# EAGLE board EEZ CF-DIC r5B1 (EAGLE 7.2.0)
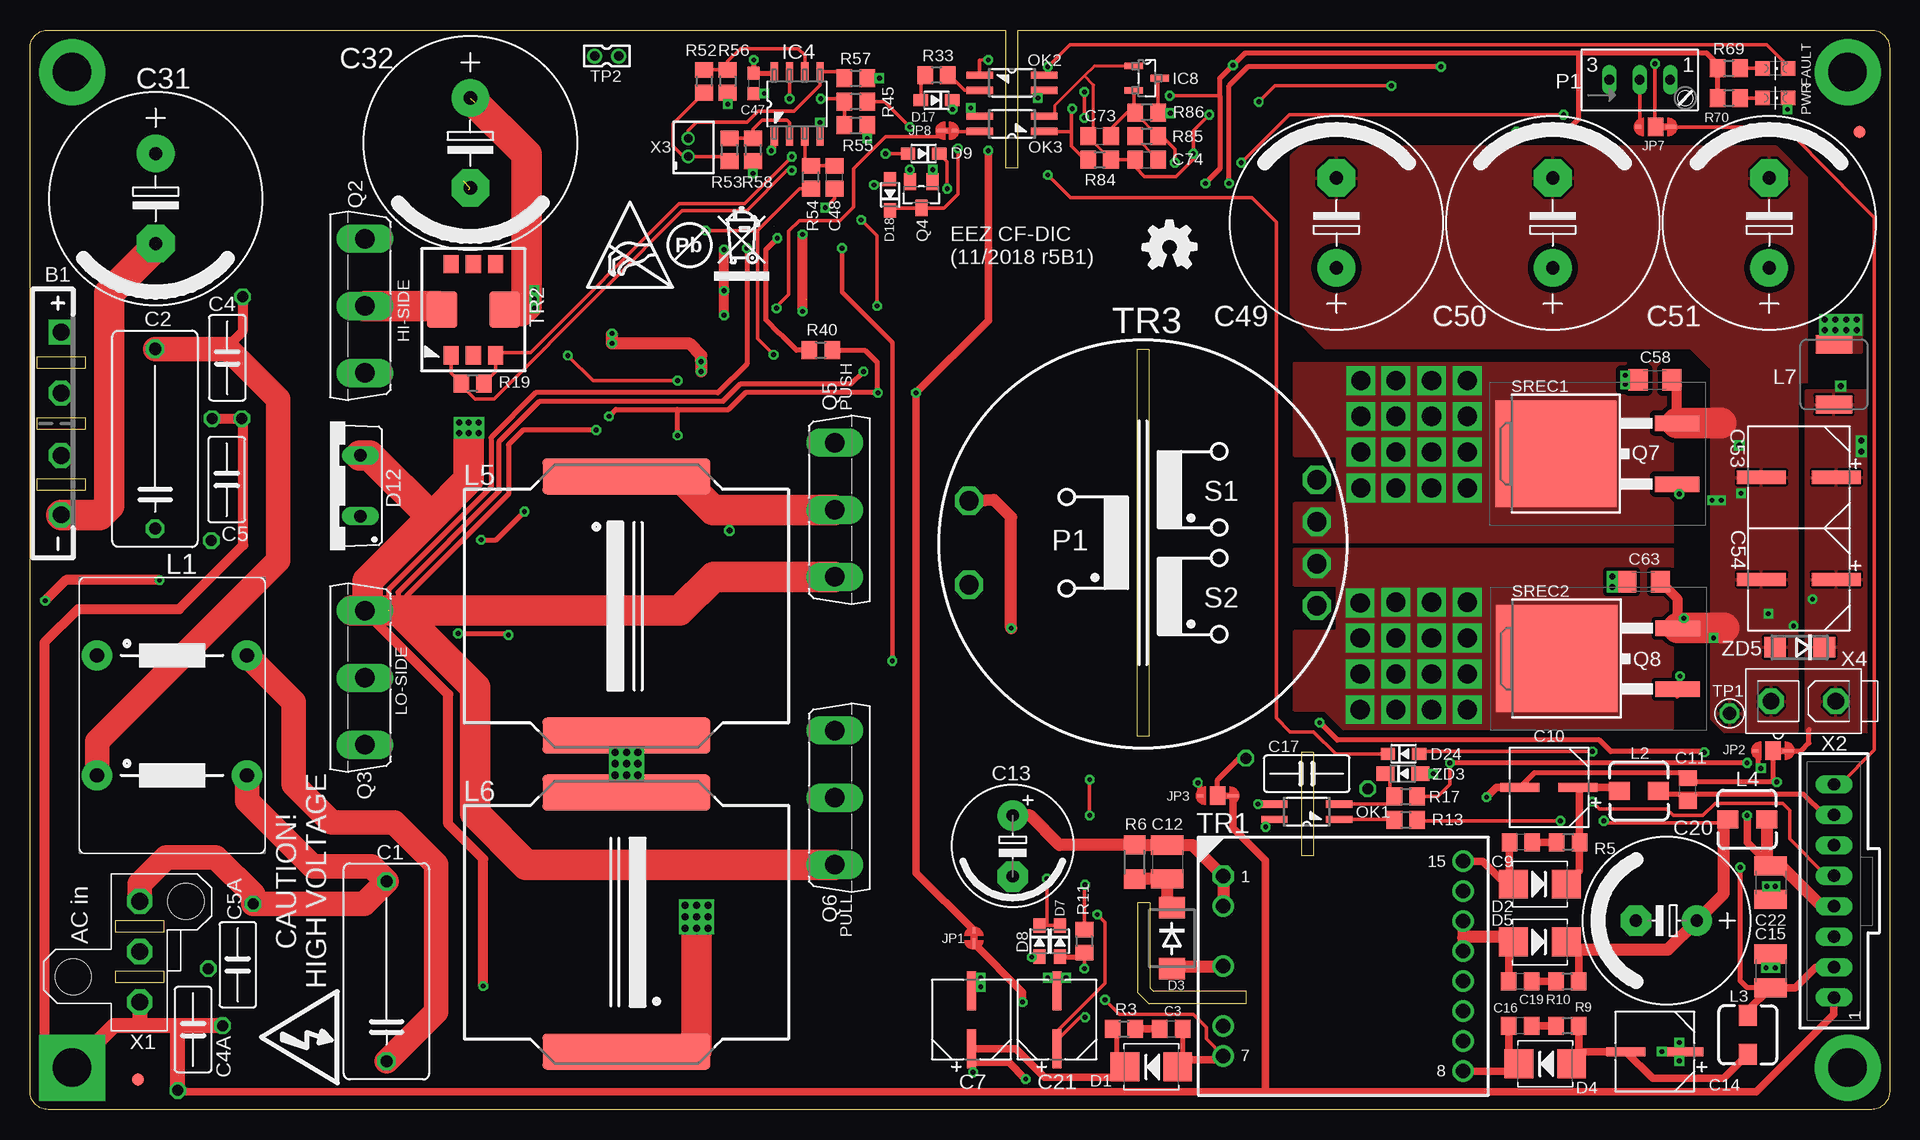
[diagram p3: board, top side]
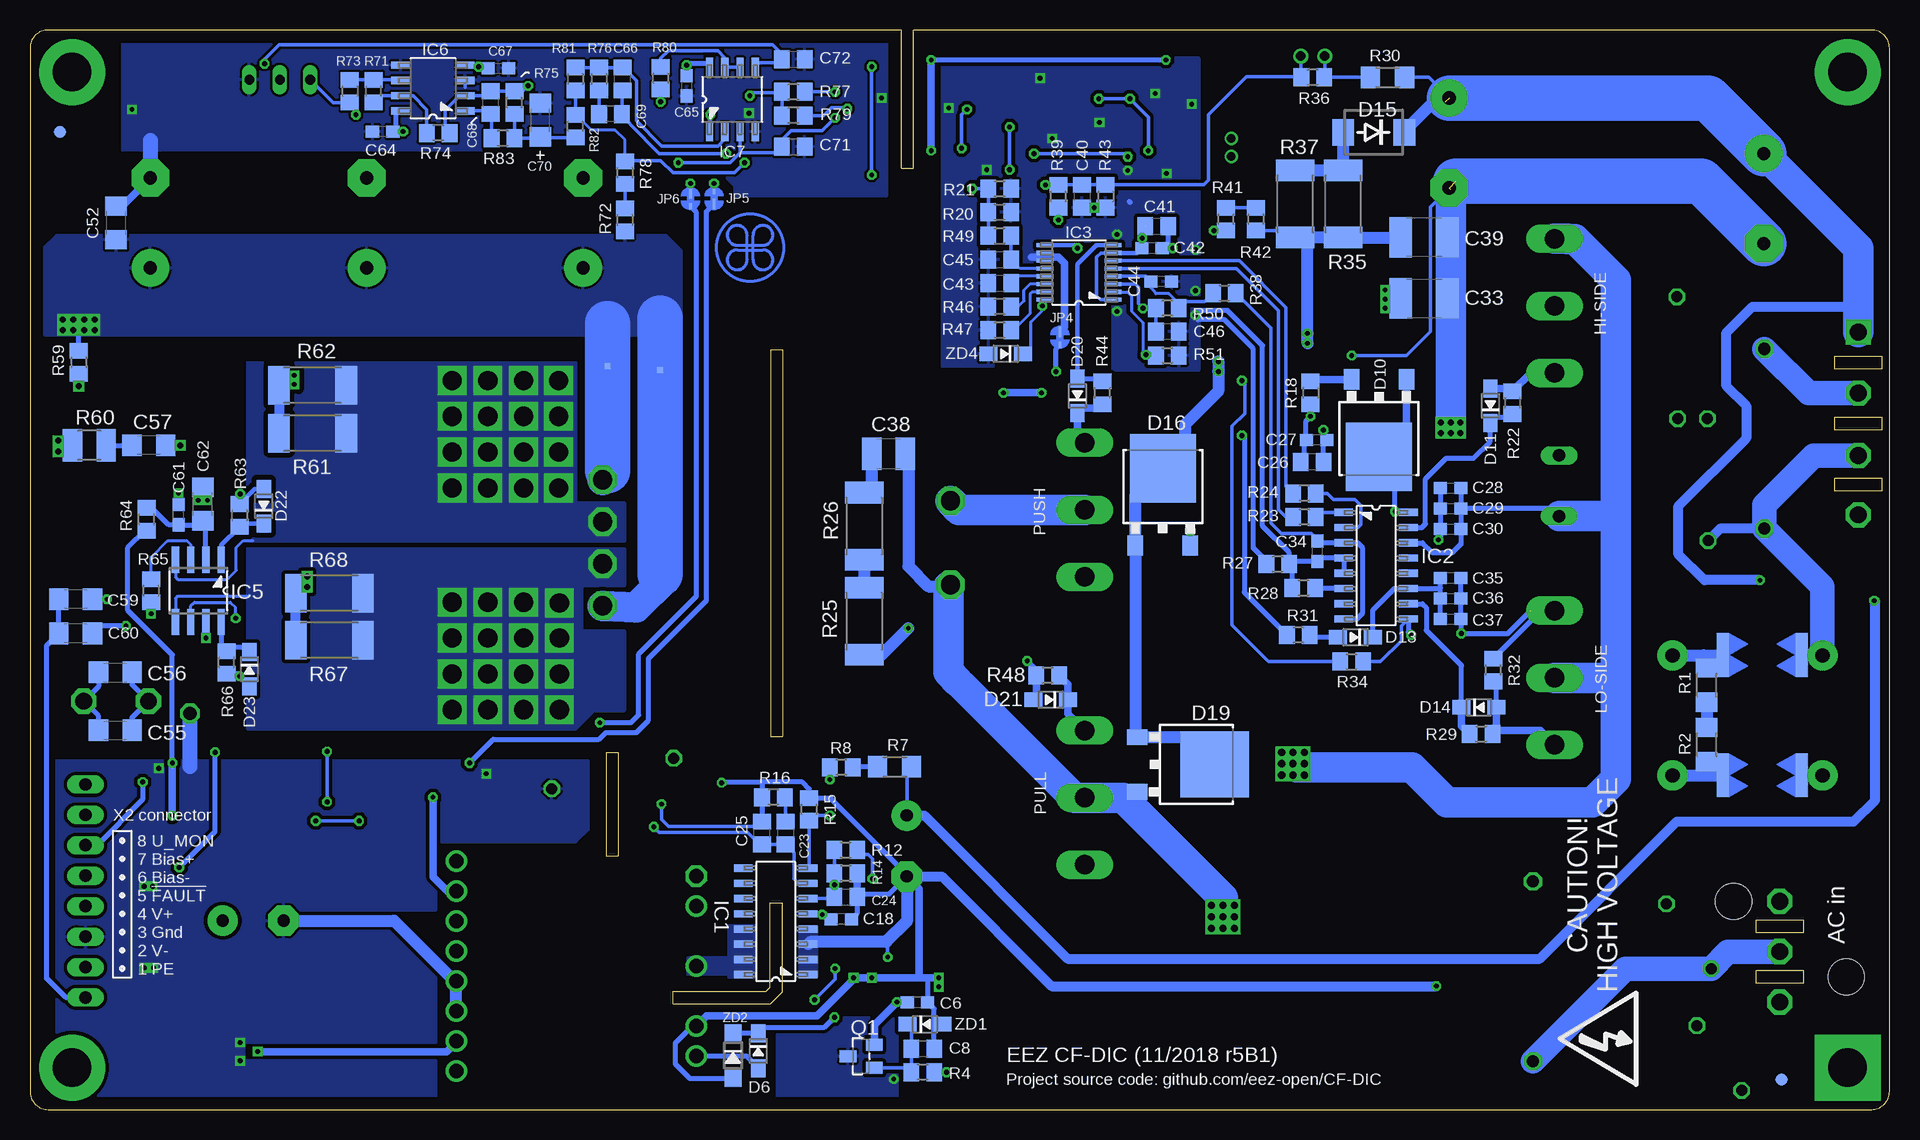
[diagram p4: board, bottom side, seen from below]

Size 155 x 90 mm. Coordinates in mm from the lower left corner, seen from the top.
Outline: 155,88.5 155,1.5 arc-90 153.5,0 1.5,0 arc-90 0,1.5 0,88.5 arc-90 1.5,90 81.34,90 81.34,78.49 82.36,78.49 82.36,90 153.5,90 arc-90 155,88.5
Outline: 92.27,63.37 92.27,31.11 93.28,31.11 93.28,63.37 92.27,63.37
Outline: 92.33,17.24 92.33,9.78 93.28,8.83 101.38,8.83 101.38,9.84 93.66,9.84 93.34,10.16 93.34,17.24 92.33,17.24
Outline: 105.98,29.78 105.98,21.14 107,21.14 107,29.78 105.98,29.78
Copper layers (1*16): Top 0.035mm / dielectric 1.5mm / Bottom 0.035mm
Design rules "default": minimum track width 6mil, minimum drill 0.3mm, track to track 6mil, track to pad 6mil, pad to pad 6mil, via to via 6mil, smd to smd 6mil, copper to edge 40mil, drill to drill 8mil, minimum pad ring 4mil, minimum via ring 8mil, stop-mask expansion 2.5mil, vias tented up to drill 0.55mm, thermal gap 8mil
Net classes: 0 default: width 0.203 mm, drill 0.3 mm, clearance 0.203 mm; 1 lvds: width 0.152 mm, drill 0.3 mm, clearance 0.152 mm to class 0, clearance 0.152 mm; 2 gnd: width 0.254 mm, drill 0.584 mm, clearance 0.254 mm

## Footprints (pad centres in the part's own frame; a part is rotated, then mirrored left to right if it is on the bottom)
GBU4K_CRE = drill 1.4 square: + -7.62,0 | drill 1.4 octagon: - 7.62,0; AC1 -2.54,0; AC2 2.667,0
C150-072X183 = drill 1.016 octagon: 1 -7.493,0; 2 7.493,0
C0805 = smd 1.3 x 1.5: 1 -0.95,0; 2 0.95,0
CY075-032X103 = drill 0.914 octagon: 1 -5.08,1.27; 2 5.08,-1.27
C0603 = smd 1.1 x 1: 1 -0.85,0; 2 0.85,0
CAPAE660X610N = smd 3.251 x 0.762: 1 -2.413,0; 2 2.413,0
C1210 = smd 1.6 x 2.7: 1 -1.4,0; 2 1.4,0
ECAP5/10.5 = drill 1.016 pad 2.54: + -2.54,0 | drill 1.016 pad 2.54 octagon: - 2.54,0
ECAP5/13 = drill 1.016 pad 2.54: + -2.54,0 | drill 1.016 pad 2.54 octagon: - 2.54,0
ECAP7.5/18 = drill 1.1 pad 3.14: + -3.75,0 | drill 1.1 pad 3.14 octagon: - 3.75,0
C1812 = smd 1.9 x 3.4: 1 -1.95,0; 2 1.95,0
C1206 = smd 1.6 x 1.8: 1 -1.4,0; 2 1.4,0
CAPAE830X1050N = smd 4.064 x 1.092: 1 -3.124,0; 2 3.124,0
EC1206 = smd 1.6 x 1.8: + -1.4,0; - 1.4,0
SMB = smd 2.4 x 2.4: A 2.2,0; C -2.2,0
DO214AA = smd 1.8 x 2.2: A 2.55,0; C -2.55,0
SOD323-W = smd 1.5 x 1.2: A 1.45,0; C -1.45,0
SOD323-R = smd 1.2 x 1: A 1.3,0; C -1.3,0
TO252 = smd 1.3 x 1.7: 1 -2.285,-5.49; 2 2.285,-5.49 | smd 5.5 x 5.7: 3 0,0.95
TO220-2 = drill 1.016 long: 1 -2.54,-2.54; 2 2.54,-2.54
LED_0805 = smd 1.2 x 1.2: A 0,-1.05; C 0,1.05
FIDUCIAL_DUAL = smd 1.016 x 1.016 bottom: B 0,0 | smd 1.016 x 1.016: T 0,0
SOIC-16 = smd 1.549 x 0.61: 1 -2.692,4.445; 2 -2.692,3.175; 3 -2.692,1.905; 4 -2.692,0.635; 5 -2.692,-0.635; 6 -2.692,-1.905; 7 -2.692,-3.175; 8 -2.692,-4.445; 9 2.692,-4.445; 10 2.692,-3.175; 11 2.692,-1.905; 12 2.692,-0.635; 13 2.692,0.635; 14 2.692,1.905; 15 2.692,3.175; 16 2.692,4.445
MTC16 = smd 1.422 x 0.356: 1 -2.845,2.275; 2 -2.845,1.625; 3 -2.845,0.975; 4 -2.845,0.325; 5 -2.845,-0.325; 6 -2.845,-0.975; 7 -2.845,-1.625; 8 -2.845,-2.275; 9 2.845,-2.275; 10 2.845,-1.625; 11 2.845,-0.975; 12 2.845,-0.325; 13 2.845,0.325; 14 2.845,0.975; 15 2.845,1.625; 16 2.845,2.275
SOIC127P600X173-8N = smd 1.55 x 0.6: 1 -2.7,1.9; 2 -2.7,0.63; 3 -2.7,-0.64; 4 -2.7,-1.91; 5 2.7,-1.91; 6 2.7,-0.64; 7 2.7,0.63; 8 2.7,1.9
SO8 = smd 0.6 x 2.2: 1 -1.905,-2.6; 2 -0.635,-2.6; 3 0.635,-2.6; 4 1.905,-2.6; 5 1.905,2.6; 6 0.635,2.6; 7 -0.635,2.6; 8 -1.905,2.6
SOT103P240X110-3N = smd 1.524 x 0.559: 1 -1.079,1.016; 2 -1.079,-1.016; 3 1.079,0
JP2-NOCUT = smd 0.889 x 0.254: 1 -0.445,0 | smd 0.508 x 0.254: 2 0.635,0
JP3-CUT = smd 1.27 x 1.524: COM 0,0 | smd 0.889 x 0.254: NC -1.27,0 | smd 0.508 x 0.254: NO 1.46,0
RN214 = drill 1.2 pad 2.54: 1 -6.25,-5; 2 6.25,-5; 3 -6.25,5; 4 6.25,5
DE0403 = smd 1.5 x 1.75: 1 0,1.626; 2 0,-1.625
MURATA_6000B = smd 3 x 14: 1 -10.8,0; 2 10.8,0
IHLP-2020BZ-11 = smd 3.048 x 1.524: 1 0,2.515; 2 0,-2.515
SO4 = smd 0.6 x 2.2: 1 -0.635,-2.7; 2 0.635,-2.7; 3 0.635,2.7; 4 -0.635,2.7
S64W = drill 0.813 long: A 2.54,1.27; E -2.54,1.27; S 0,1.27
SOT23-BEC = smd 1 x 1.4: B -0.95,-1.1; C 0,1.1; E 0.95,-1.1
TO247BV = drill 1.6 long: D 0,-2.921; G -5.588,-2.921; S 5.588,-2.921
SOT23 = smd 1 x 1.4: 1 -0.95,-1.1; 2 0.95,-1.1; 3 0,1.1
TO263 = smd 1.3 x 3.7: 1 -2.54,-7.87; 2 2.54,-7.87 | smd 8.9 x 10.1: 3 0,2.23
R1206 = smd 1.6 x 1.803: 1 -1.422,0; 2 1.422,0
R0805 = smd 1.3 x 1.5: 1 -0.95,0; 2 0.95,0
R2512 = smd 1.8 x 3.2: 1 -2.8,0; 2 2.8,0
R1210 = smd 1.6 x 2.7: 1 -1.4,0; 2 1.4,0
PCB-SAR_2.4MM = smd 3.632 x 1.016: 1 0,-3.302; 2 0,3.302
SHORT_NOHOLE = smd 0.5 x 0.25 bottom: P$1 0,0.117; P$2 0,-0.117
PCB_SHIELD_TAB = drill 1.1 octagon: 1 0,0
2MM-2 = drill 0.8 pad 1.27: 1 0,-1; 2 0,1
FERYSTER_5572 = drill 1.2 octagon: 1 -10,7.5 | drill 1.2: 2 -10,5; 4 -10,0; 6 -10,-5; 7 -10,-7.5; 8 10,-8.75; 9 10,-6.25; 10 10,-3.75; 11 10,-1.25; 12 10,1.25; 13 10,3.75; 14 10,6.25; 15 10,8.75
MURATA_5300 = smd 1.27 x 1.524: 1 -1.854,-3.81; 2 0,-3.81; 3 1.854,-3.81; 4 1.854,3.81; 5 0,3.81; 6 -1.854,3.81 | smd 2.54 x 3.048: 7 2.616,0; 8 -2.616,0
VAC_DUAL_SEC = drill 1.6 octagon: P1 -14.5,3.5; P1_DOT -14.5,-3.5; S1 14.5,5.25; S1_DOT 14.5,1.75; S2 14.5,-1.75; S2_DOT 14.5,-5.25
MINIFIT_39301039_CRE = drill 1.4 octagon: 1 0,4.2; 2 0,0; 3 0,-4.2 | hole 3: 5.55,2.1; -3.85,-4.2
70543-08 = drill 1.016 long: 1 -8.89,0; 2 -6.35,0; 3 -3.81,0; 4 -1.27,0; 5 1.27,0; 6 3.81,0; 7 6.35,0; 8 8.89,0
B2B-ZR = drill 0.7 pad 1.1: 1 -0.75,0; 2 0.75,0
MINIFIT_5566-02A = drill 1.4 octagon: 1 0,2.7; 2 0,-2.7
SOD123 = smd 1.4 x 1.4: A 1.9,0; C -1.9,0
DO214AC = smd 1.8 x 1.7: A 2.05,0; C -2.05,0

## Placement (x,y rotation side)
B1  GBU4K  [GBU4K_CRE]  2.6,57.2 270 top
C1  MKP-X2-220NR15/310  [C150-072X183]  29.72,11.52 90 top
C2  MKP-X2-220NR15/310  [C150-072X183]  10.42,55.92 90 top
C3  3n3  [C0805]  95.12,6.73 0 top
C4  CY1Y-470P  [CY075-032X103]  16.45,62.67 90 top
C4A  N.C.  [CY075-032X103]  13.6,6.67 90 top
C5  CY1Y-470P  [CY075-032X103]  16.38,52.51 270 top
C5A  N.C.  [CY075-032X103]  17.32,12.07 90 top
C6  N.C.  [C0603]  81.03,8.95 0 bottom
C7  EEEFK1V470P  [CAPAE660X610N]  78.49,7.49 90 top
C8  470n  [C0805]  80.58,5.08 0 bottom
C9  3n3  [C0805]  124.27,22.29 180 top
C10  EEEFK1V470P  [CAPAE660X610N]  126.62,26.86 180 top
C11  1u  [C0805]  138.18,26.67 90 top
C12  1n/1kV  [C1210]  94.81,20.64 270 top
C13  UCY2G6R8MPD  [ECAP5/10.5]  81.92,21.97 270 top
C14  EEEFK1V470P  [CAPAE660X610N]  135.45,4.83 180 top
C15  4u7  [C1210]  145.1,11.56 270 top
C16  3n3  [C0805]  124.21,6.99 180 top
C17  CY1Y-470P  [CY075-032X103]  106.43,28 0 top
C18  100n  [C0603]  87.38,15.88 180 bottom
C19  3n3  [C0805]  124.21,10.67 180 top
C20  470u  [ECAP5/13]  136.4,15.75 180 top
C21  EEEFK1V470P  [CAPAE660X610N]  85.6,7.49 90 top
C22  4u7  [C1210]  145.1,18.92 270 top
C23  33n  [C0805]  92.01,23.05 270 bottom
C24  100p  [C0805]  87,17.72 0 bottom
C25  2n2  [C0805]  93.98,23.05 90 bottom
C26  1u  [C0805]  48.13,53.98 180 bottom
C27  100n  [C0603]  47.75,55.82 180 bottom
C28  10n  [C0603]  36.58,51.82 0 bottom
C29  100n  [C0603]  36.58,50.1 0 bottom
C30  100n  [C0603]  36.58,48.39 0 bottom
C31  UCY2G121MHD  [ECAP7.5/18]  10.48,75.95 270 top
C32  UCY2G121MHD  [ECAP7.5/18]  36.7,80.58 270 top
C33  100n/500V  [C1812]  38.8,67.63 0 bottom
C34  100n  [C0603]  47.69,46.55 90 bottom
C35  10n  [C0603]  36.58,44.32 0 bottom
C36  100n  [C0603]  36.58,42.61 0 bottom
C37  100n  [C0603]  36.58,40.89 0 bottom
C38  4n7/200V  [C1210]  83.44,54.67 0 bottom
C39  100n/500V  [C1812]  38.8,72.71 180 bottom
C40  10n  [C0805]  67.31,76.14 270 bottom
C41  1u  [C0805]  61.09,73.66 0 bottom
C42  100n  [C0603]  61.47,71.82 0 bottom
C43  10n  [C0805]  74.17,68.9 0 bottom
C44  100n  [C0603]  60.71,69.02 180 bottom
C45  1n  [C0805]  74.17,70.87 0 bottom
C46  100p  [C0805]  60.2,64.83 180 bottom
C47  100n  [C0603]  60.33,85.53 270 top
C48  1u  [C0805]  67.06,77.72 90 top
C49  UPW1J152MHD  [ECAP7.5/18]  108.9,73.91 90 top
C50  UPW1J152MHD  [ECAP7.5/18]  126.94,73.91 90 top
C51  UPW1J152MHD  [ECAP7.5/18]  144.97,73.91 90 top
C52  1u/100V  [C1206]  147.83,73.91 90 bottom
C53  HHXC630ARA330MHA0G  [CAPAE830X1050N]  147.45,52.7 180 top
C54  HHXC630ARA330MHA0G  [CAPAE830X1050N]  147.45,44.2 180 top
C55  1u/100V  [C1206]  147.89,31.62 0 bottom
C56  100n/100V  [C1206]  147.89,36.45 0 bottom
C57  N.C.  [C1206]  145.1,55.37 180 bottom
C58  4n7/200V  [C1206]  135.45,60.83 0 top
C59  N.C.  [C1206]  151.19,42.55 180 bottom
C60  N.C.  [C1206]  151.19,39.69 180 bottom
C61  100n  [C0603]  142.62,49.59 90 bottom
C62  4u7  [C1206]  140.59,50.48 90 bottom
C63  4n7/200V  [C1206]  134.49,44.01 0 top
C64  100n  [C0603]  125.6,81.53 180 bottom
C65  100n  [C0603]  100.27,85.34 270 bottom
C66  100p  [C0805]  105.6,85.92 90 bottom
C67  100n  [C0603]  115.95,86.8 0 bottom
C68  100p  [C0805]  116.59,83.95 90 bottom
C69  33n  [C0805]  106.62,82.99 180 bottom
C70  4u7  [EC1206]  112.46,82.49 90 bottom
C71  1u  [C0805]  91.38,80.26 0 bottom
C72  N.C.  [C0805]  91.38,87.57 0 bottom
C73  N.C.  [C0805]  89.15,81.15 0 top
C74  1n  [C0805]  93.09,79.18 0 top
D1  SS110B  [SMB]  93.47,3.56 0 top
D2  SS110B  [SMB]  125.86,18.8 180 top
D3  US1K-DIO  [DO214AA]  95.19,14.29 270 top
D4  SS110B  [SMB]  126.3,3.81 0 top
D5  SS110B  [SMB]  125.86,13.97 180 top
D6  1N5819HW-7-F  [SOD323-W]  94.3,4.89 270 bottom
D7  BAS316  [SOD323-R]  85.85,14.03 270 top
D8  BAS316  [SOD323-R]  84.14,14.03 270 top
D9  BAS316  [SOD323-R]  74.49,79.69 180 top
D10  C3D02065E  [TO252]  42.55,55.37 180 bottom
D11  N.C.  [SOD323-W]  33.27,58.67 90 bottom
D12  C3D06065A  [TO220-2]  25,52 90 top
D13  1N5819HW-7-F  [SOD323-W]  44.51,39.37 180 bottom
D14  N.C.  [SOD323-W]  34.23,33.53 0 bottom
D15  US1M-DIO  [DO214AA]  42.99,81.47 180 bottom
D16  C3D02065E  [TO252]  60.58,52.51 0 bottom
D17  BAS316  [SOD323-R]  75.56,84.14 180 top
D18  BAS316  [SOD323-R]  71.69,76.26 90 top
D19  C3D02065E  [TO252]  57.21,28.77 270 bottom
D20  1N5819HW-7-F  [SOD323-W]  67.69,59.5 90 bottom
D21  1N5819HW-7-F  [SOD323-W]  69.91,34.16 180 bottom
D22  1N5819HW-7-F  [SOD323-W]  135.51,50.29 90 bottom
D23  1N5819HW-7-F  [SOD323-W]  136.72,36.7 270 bottom
D24  BAS316  [SOD323-R]  114.49,29.65 0 top
EEZ_SIGNATURE  SIGNATURESMALL  [SIGNATURE_5MM]  94.98,71.86 180 top
FAULT  LTST-C170KRKT  [LED_0805]  145.48,86.8 270 top
FM1  FIDUCIAL_2  [FIDUCIAL_DUAL]  152.5,81.5 0 top
FM2  FIDUCIAL_2  [FIDUCIAL_DUAL]  9,2.5 0 top
IC1  VIPer35L  [SOIC-16]  92.84,15.68 180 bottom
IC2  SI8233BB-D-IS1  [SOIC-16]  42.8,45.34 0 bottom
IC3  LM5041B  [MTC16]  67.56,69.79 180 bottom
IC4  LM258D  [SOIC127P600X173-8N]  63.94,83.82 90 top
IC5  IR11688STRPBF  [SO8]  140.97,43.24 180 bottom
IC6  TL072  [SOIC127P600X173-8N]  121.41,85.15 180 bottom
IC7  TL103W  [SOIC127P600X173-8N]  96.46,84.2 90 bottom
IC8  TL431  [SOT103P240X110-3N]  93.09,85.98 0 top
JP1  JP2-NOCUT  [JP2-NOCUT]  78.68,14.29 90 top
JP2  JP3-CUT  [JP3-CUT]  145.29,29.91 180 top
JP3  JP3-CUT  [JP3-CUT]  99,26.16 180 top
JP4  JP2-NOCUT  [JP2-NOCUT]  69.15,64.39 270 bottom
JP5  JP2-NOCUT  [JP2-NOCUT]  97.98,75.95 90 bottom
JP6  JP2-NOCUT  [JP2-NOCUT]  99.95,75.95 270 bottom
JP7  JP3-CUT  [JP3-CUT]  135.51,81.92 180 top
JP8  JP2-NOCUT  [JP2-NOCUT]  76.45,81.6 0 top
L1  RN214-2.5-02-3M3  [RN214]  11.85,32.85 0 top
L2  DLG-0403-180  [DE0403]  134.11,26.54 90 top
L3  DLG-0403-180  [DE0403]  143.19,6.22 180 top
L4  DLG-0403-180  [DE0403]  143.13,24.19 90 top
L5  60B684C  [MURATA_6000B]  49.72,41.97 270 top
L6  60B684C  [MURATA_6000B]  49.72,15.62 90 top
L7  IHLP2020CZER3R3M11  [IHLP-2020BZ-11]  150.37,61.28 0 top
OK1  TLP291-GB.SE-T  [SO4]  106.43,24.83 90 top
OK2  TLP291-GB.SE-T  [SO4]  81.85,85.6 270 top
OK3  TLP291-GB.SE-T  [SO4]  81.85,82.17 90 top
P1  T910W-50K  [S64W]  134.18,84.58 0 top
PWR  LTST-C170YKT  [LED_0805]  145.48,84.33 270 top
Q1  MMBT5551  [SOT23-BEC]  85.72,4.45 90 bottom
Q2  C3M0280090D  [TO247BV]  25,67 90 top
Q3  C3M0280090D  [TO247BV]  25,36 90 top
Q4  NYC0102BLT1G  [SOT23]  74.3,76.26 180 top
Q5  C3M0280090D  [TO247BV]  70,50 270 top
Q6  C3M0280090D  [TO247BV]  70,26 270 top
Q7  IRFS4321PBF  [TO263]  129.41,54.67 90 top
Q8  IRFS4321PBF  [TO263]  129.48,37.59 90 top
R1  220K  [R1206]  15.24,35.38 270 bottom
R2  220K  [R1206]  15.24,30.43 270 bottom
R3  120R  [R0805]  91.19,6.73 0 top
R4  1K8  [R0805]  80.58,3.11 180 bottom
R5  120R  [R0805]  128.21,22.29 180 top
R6  220K  [R1206]  92.08,20.64 270 top
R7  220K  [R1206]  82.93,28.57 180 bottom
R8  100K  [R0805]  87.38,28.51 180 bottom
R9  120R  [R0805]  128.14,6.99 180 top
R10  120R  [R0805]  128.14,10.67 180 top
R11  N.C.  [R0805]  87.88,14.03 270 top
R12  47K  [R0805]  87,21.65 0 bottom
R13  750R  [R0805]  114.68,24.13 180 top
R14  12K  [R0805]  87,19.68 180 bottom
R15  1K8  [R0805]  90.04,25.02 90 bottom
R16  47K  [R0805]  93.03,26.04 180 bottom
R17  1K  [R0805]  114.68,26.1 0 top
R18  10R  [R0805]  48.26,59.75 270 bottom
R19  10K  [R0805]  36.89,60.54 180 top
R20  6R2  [R0805]  74.17,74.8 0 bottom
R21  N.C.  [R0805]  74.17,76.77 0 bottom
R22  10R  [R0805]  31.43,58.93 270 bottom
R23  100R  [R0805]  48.77,49.4 180 bottom
R24  100R  [R0805]  48.77,51.37 180 bottom
R25  22R/2-3W  [R2512]  85.47,40.7 270 bottom
R26  22R/2-3W  [R2512]  85.47,48.64 270 bottom
R27  1R  [R0805]  50.99,45.47 180 bottom
R28  30K  [R0805]  48.83,43.5 0 bottom
R29  10R  [R0805]  34.04,31.31 0 bottom
R30  220K  [R1206]  41.85,86.04 180 bottom
R31  10R  [R0805]  49.28,39.56 180 bottom
R32  47K  [R0805]  33.02,36.64 90 bottom
R33  1K  [R0805]  75.56,86.23 180 top
R34  1R  [R0805]  44.83,37.34 0 bottom
R35  22R/2-3W  [R2512]  45.53,75.5 90 bottom
R36  100K  [R0805]  48.07,86.04 180 bottom
R37  22R/2-3W  [R2512]  49.53,75.5 90 bottom
R38  10R  [R0805]  55.44,68.07 0 bottom
R39  1K  [R0805]  69.28,76.14 90 bottom
R40  10R  [R0805]  65.91,63.31 0 top
R41  30K  [R0805]  55.31,74.23 90 bottom
R42  100K  [R0805]  52.83,74.23 270 bottom
R43  10K  [R0805]  65.34,76.14 270 bottom
R44  22R  [R0805]  65.6,59.75 90 bottom
R45  4K7  [R0805]  68.83,84.01 180 top
R46  33K  [R0805]  74.17,66.93 180 bottom
R47  51K  [R0805]  74.17,64.96 180 bottom
R48  22R  [R0805]  70.17,36.2 180 bottom
R49  1K  [R0805]  74.17,72.83 0 bottom
R50  N.C.  [R0805]  60.2,66.8 180 bottom
R51  750R  [R0805]  60.2,62.87 0 bottom
R52  4K7  [R0805]  56.2,85.72 270 top
R53  5K6  [R0805]  58.29,80.01 270 top
R54  30K  [R0805]  65.09,77.72 90 top
R55  1K  [R0805]  68.83,82.04 0 top
R56  30K  [R0805]  58.17,85.72 270 top
R57  10K  [R0805]  68.83,85.98 0 top
R58  1K  [R0805]  60.26,80.01 270 top
R59  120R  [R0805]  150.94,62.29 270 bottom
R60  N.C.  [R1210]  150.05,55.37 180 bottom
R61  22R/2-3W  [R2512]  131.44,56.39 180 bottom
R62  22R/2-3W  [R2512]  131.44,60.39 180 bottom
R63  3R3  [R0805]  137.54,49.53 270 bottom
R64  10R  [R0805]  145.29,49.21 90 bottom
R65  47K  [R0805]  144.91,43.24 270 bottom
R66  3R3  [R0805]  138.62,37.27 90 bottom
R67  22R/2-3W  [R2512]  130.05,39.12 180 bottom
R68  22R/2-3W  [R2512]  130.05,43.05 180 bottom
R69  470R  [R0805]  141.6,86.8 0 top
R70  470R  [R0805]  141.6,84.33 0 top
R71  10K  [R0805]  126.36,84.9 90 bottom
R72  316K  [R0805]  105.41,74.17 270 bottom
R73  10K  [R0805]  128.33,84.9 270 bottom
R74  750R  [R0805]  120.97,81.41 180 bottom
R75  750R  [R0805]  114.62,83.95 90 bottom
R76  30K  [R0805]  107.57,85.92 270 bottom
R77  1K8  [R0805]  91.38,84.84 180 bottom
R78  12K  [R0805]  105.41,78.11 270 bottom
R79  470R  [R0805]  91.38,82.87 180 bottom
R80  750R  [R0805]  102.43,85.98 90 bottom
R81  10K  [R0805]  109.54,85.92 270 bottom
R82  16K  [R0805]  109.54,81.98 90 bottom
R83  220R  [R0805]  115.57,80.96 180 bottom
R84  750R  [R0805]  89.15,79.18 0 top
R85  6K8  [R0805]  93.09,81.15 0 top
R86  7K5  [R0805]  93.09,83.12 180 top
SAR1  PCB 2.4mm  [PCB-SAR_2.4MM]  10.6,37.9 270 bottom
SAR2  PCB 2.4mm  [PCB-SAR_2.4MM]  10.6,27.86 270 bottom
SH1  [SHORT_NOHOLE]  10.48,72.07 180 bottom
SH2  [SHORT_NOHOLE]  106.87,61.98 180 top
SH3  [SHORT_NOHOLE]  102.49,61.66 0 top
TP1  [PCB_SHIELD_TAB]  141.67,33.02 180 top
TP2  [2MM-2]  48.07,87.82 270 top
TR1  Feryster 5572  [FERYSTER_5572]  109.47,11.95 0 top
TR2  53100C  [MURATA_5300]  36.96,66.67 0 top
TR3  VAC T60006-L2025-W380  [VAC_DUAL_SEC]  92.77,47.24 0 top
U$2  [RECYCLE_BIN1/8]  57.03,69.09 0 top
U$4  [ESD_SYMBOL]  46.45,68.56 0 top
U$5  [PB_SMALL]  54.99,72.07 180 top
X1  39-30-1039  [MINIFIT_39301039_CRE]  9.16,13.16 180 top
X2  90136-1208  [70543-08]  150.37,18.22 90 top
X3  B2B-ZR  [B2B-ZR]  54.86,80.2 90 top
X4  39-28-1023  [MINIFIT_5566-02A]  147.83,34.04 270 top
ZD1  BZX384-C13  [SOD323-W]  80.39,7.11 0 bottom
ZD2  BZT52C20-DC  [SOD123]  96.39,4.51 270 bottom
ZD3  MMSZ5V1T1G  [SOD323-W]  114.43,28 0 top
ZD4  PDZ6.2B  [SOD323-W]  73.66,62.99 180 bottom
ZD5  SMAJ58A-TR  [DO214AC]  147.51,38.54 180 top

## Tracks (layer width: path | path; a pad name or v marks a point on that pad's centre or on a via)
0V  (via drill 0.4, 0.5)  (4 unrouted)
  Top 0.305: D8.A 83.54,12.73 v83.5,12.7 | OK1.3 v102.36,25.46 | v53.98,60.77 46.93,60.77 v44.83,62.87 | 28.13,42.02 28.13,41.8 Q3.S | 31.43,41.59 29.97,41.59 29.94,41.56 29.94,42.13 29.91,42.16
  Top 0.406: JP3.NO 97.54,27.05 v97.35,27.24 | v59.75,71.82 59.75,62.17 57.34,59.75 42.16,59.75 38.42,56.01 38.42,51.88 29.91,43.37 29.91,42.16 | 30.67,40.75 30.67,41.59 30.67,43.12 39.12,51.56 39.12,55.69 42.48,59.05 57.78,59.05 59.24,60.52 68.45,60.52 v69.47,61.53 | v47.18,56.64 41.08,56.64 39.88,55.44 39.88,51.31 31.43,42.86 31.43,41.59 | v35.69,39.69 39.75,39.69 v39.88,39.56 | C7.2 78.8,10.22 v79.25,10.22 v79.25,10.99 | C21.2 85.6,10.92 85.66,10.99 | v37.4,57.28 v36.58,57.28 v35.75,57.28 v35.75,56.39 v36.58,56.39 v37.4,56.39
  Top 0.61: v86.36,10.99 85.66,10.99 v84.84,10.99
  Top 0.813: Q3.S 28.1,41.37 34.86,34.61 34.86,23.81 37.78,20.89 v37.78,10.29
  Top 2.54: 33.47,49.4 36.58,52.51 v36.58,56.39 | 33.47,49.4 28.13,44.07 28.13,42.02 | 30.67,41.59 37.08,35.18 37.08,24.7 41.37,20.41 Q6.S | 26.86,41.59 30.67,41.59 | 30.67,41.59 31.43,41.59 54.17,41.59 56.98,44.41 Q5.S | D12.2 28.33,54.54 33.47,49.4
  Bottom 0.305: v83.5,12.7 83.5,13.84 83.63,13.97 | v102.36,25.46 102.36,24.19 101.79,23.62 94.36,23.62 C25.2 | R16.2 | 45.78,37.21 R34.1 51.75,37.34 54.8,40.39 54.8,56.96 53.72,58.04 53.72,60.52 v53.98,60.77 | R34.2 42.42,37.34 40.7,39.05 40.7,40.3 IC2.9 | C32.- 38.29,75.24 38.29,64.83 40.26,62.87 v44.83,62.87 | C39.1 36.58,72.71 | C33.2 36.64,67.63 36.58,67.56
  Bottom 0.406: 80.18,10.96 C6.2 79.63,8.41 79.63,7.18 | C8.2 79.63,7.18 | ZD1.A 79.57,7.11 79.63,7.18 | R14.1 86.05,19.5 86.04,17.97 83.38,17.97 C13.- 81.92,19.56 88.33,25.97 R15.2 90.04,26.73 90.61,27.3 93.98,27.3 | C25.2 R16.2 93.98,27.3 | 93.98,27.3 97.28,27.3 v97.35,27.24 | C24.2 86.05,16.36 C18.1 | ZD2.A 100.01,2.6 101.22,3.81 101.22,5.52 99.79,6.95 TR1.6 | C35.2 C36.2 C37.2 35.69,41.11 v35.69,39.69 31.81,39.69 29.91,41.59 29.02,41.59 | C41.2 60.14,72.3 C42.2 v59.75,71.82 | IC2.9 40.11,39.79 v39.88,39.56 | v47.18,56.64 47.18,56.09 C27.1 47.18,55.53 C26.1 | R32.2 29.02,41.59 | 29.02,41.59 Q3.S | v69.47,61.53 69.47,63.44 JP4.2 | 36.58,57.4 v36.58,57.28
  Bottom 0.61: 80.9,10.99 v84.84,10.99 v86.36,10.99 86.23,10.99 89.41,7.81 98.61,7.81 TR1.6 | 80.9,10.99 80.2,10.99 | 80.2,10.99 v79.25,10.99 | 80.18,10.96 80.2,10.99 | R14.1 C24.2 | 80.9,10.99 80.9,18.41 C13.-
  Bottom 0.813: v37.78,10.29 69.85,10.29 78.99,19.43 C13.-
  Bottom 1.016: C13.- 81.92,15.68 83.63,13.97 89.95,13.97 IC1.3
  Bottom 2.54: 36.58,57.4 36.58,67.56 36.58,72.71 36.58,76.7
  Bottom 3.81: C31.- 15.69,77.41 36.13,77.41
  pour Bottom (no thermals): 89.41,11.05 89.41,15.24 90.87,15.24 90.87,11.05
6VAC
  Top 0.61: C19.2 123.26,13.44 | 123.26,13.44 D5.A | 123.26,13.44 123.26,14.41 123.25,14.41 | 119.54,14.41 119.47,14.35
  Top 1.016: TR1.13 119.47,14.35 TR1.12 | 123.25,14.41 119.54,14.41
7VAC
  Top 0.61: TR1.8 123.49,3.2 D4.C 123.26,4.66 C16.2
15VAC
  Top 0.61: TR1.15 121.09,20.7 122.68,19.11 123.59,19.11 D2.A 123.32,19.39 C9.2
!FAULT  (via drill 0.4)
  Top 0.305: D24.C 108.84,29.65 107,31.5 105.03,31.5 103.89,32.64 103.89,73.98 101.85,76.01 86.74,76.01 v84.84,77.92 | FAULT.C 146.53,87.03 144.78,88.77 86.68,88.77 v84.84,86.93 84.84,86.2 OK2.4
  Bottom 0.305: v84.84,77.92 v84.84,86.93
+2.5VREF  (via drill 0.4)
  Top 0.305: v127.83,82.93 104.97,82.93 v100.97,78.93 | v87.88,84.84 v87.88,82.68
  Bottom 0.305: P1.E 129.73,83.95 R73.2 127.89,83.95 127.83,83.88 v127.83,82.93 | 95.82,81.82 IC7.3 | 92.64,80.33 C71.1 | 90.43,85.22 R77.1 v87.88,84.84 | IC7.3 | 95.82,79.76 96.65,78.93 v100.97,78.93 | IC7.3 95.82,79.76 | C71.1 92.33,80.83 91.57,81.6 88.96,81.6 v87.88,82.68 | 95.82,79.76 92.83,79.76 C71.1
+5VREF
  Top 0.305: R53.2 57.9,79.45 X3.1 54.47,79.45 53.59,80.33 53.59,82.17 R52.2
+6V_REC  (via drill 0.4)
  Top 0.305: 115.82,24.13 R13.1 115.89,24.07 v127.57,24.07 | v131.19,24.07 131.38,23.88 141.19,23.88 L4.1
  Top 0.61: R10.1 129.09,13.15 128.91,13.34
  Top 1.016: D5.C 127.99,13.42 128.08,13.34 128.91,13.34 136.53,13.34 C20.+ 141.19,18 141.19,23.88
  Bottom 0.305: v131.19,24.07 v127.57,24.07
+12V  (via drill 0.4)
  Top 0.305: OK2.1 79.15,87.47 v79.88,87.5
  Top 0.406: v60.33,87.5 C47.1 61.91,86.39 IC4.8 | R40.2 69.6,63.31 70.61,62.29 70.61,59.69 v70.67,59.75 59.63,59.75 58.23,58.36 53.98,58.36 | v48.26,57.78 48.83,58.36 53.98,58.36 | v53.98,56.2 53.98,58.36
  Top 0.61: JP1.2 73.85,19.75 v73.85,59.75 79.88,65.79 v79.88,79.95
  Bottom 0.406: v53.98,56.2 53.78,56.01 53.78,43.12 R31.2 | 47.76,58.42 R18.2 v48.26,57.78 48.64,57.4 48.64,55.85 C27.2 48.77,55.65 48.77,53.98 C26.2 | v79.88,87.5 v60.33,87.5
  Bottom 0.61: v70.67,59.75 v73.85,59.75 | v79.88,87.5 v79.88,79.95
+15V_REC
  Top 0.61: D2.C 129.16,19.89 R5.1 129.16,26.74 C10.1 132.17,26.86 L2.1
-7V_REC
  Top 0.61: R9.1 129.09,4.51 | 129.09,4.51 129.09,4.4 D4.A | 129.09,4.51 129.41,4.83 C14.2 135.25,2.6 141.2,2.6 L3.1 142.9,4.6
-15V  (via drill 0.4)
  Top 0.406: C10.2 125.41,28.07 138.18,28.07 C11.2 | 138.31,28 C11.2 | JP2.COM 145.29,27.62 v145.61,27.3 138.49,27.3 C11.2
  Top 0.61: C10.2 122.24,26.86 v121.41,26.04
  Bottom 0.406: v145.61,27.3 145.61,25.84 149.42,22.04 X2.6
  Bottom 0.61: TR1.14 120.21,18.2 121.41,19.41 v121.41,26.04
AC_L_IN
  Top 2.032: C1.1 33.85,8.15 33.85,20.45 30.35,23.94 25.15,23.94 21.97,27.11 21.97,33.98 L1.4
  Bottom 1.016: L1.4 15.49,37.85 | 15.49,37.85 13.95,37.85 SAR1.1 | R1.1 15.24,37.6 15.49,37.85
  Bottom 2.032: C1.1 22,11.74 C4A.2 13.46,13.16 X1.2
AC_N_IN
  Top 2.032: L1.2 18.1,25.72 23.56,20.26 28.48,20.26 C1.2 27.86,17.15 C5A.2 18.59,17.92 15.49,21.02 11.37,21.02 9.15,18.81 X1.3
  Bottom 1.016: L1.2 15.18,27.86 | 15.18,27.86 13.91,27.86 SAR2.1 | R2.2 15.24,27.92 15.18,27.86
AGND  (via drill 0.4)
  Top 0.305: TR2.1 35.1,61.38 R19.2 35.94,60.39 37.08,59.24 38.67,59.24 47.85,68.42 48.01,68.58 54.36,74.93 59.75,74.93 63.12,78.3 v63.5,78.3 | OK3.3 78.55,82.8 78.42,82.93 v78.42,83.5 | v70.8,85.98 R57.2 | v69.79,80.96 R55.2 | IC4.4 v65.86,82.29 v65.85,82.3 | C47.2 61.19,84.68 v61.21,84.71 | R56.2 v58.17,83.82 | Q4.1 75.25,78.04 v75.25,78.36 | R58.2 v60.26,78.04 | C48.1 67.06,75.95 v66.29,75.18
  Top 0.813: v64.39,66.55 v64.39,72.96 | v57.85,71.69 v57.85,68.26 v57.85,66.23
  Bottom 0.406: IC2.5 IC2.4 47.41,45.97 C34.1 49.81,45.7 R27.1 | v57.85,66.23 57.66,65.85 55.44,65.85 53.02,63.44 53.02,46.8 51.94,45.72 R27.2 | 57.85,66.42 57.66,66.61 55.18,66.61 52.26,63.69 52.26,48.64 50.04,46.42 R27.1 | 63.37,75.69 63.31,75.63 | R28.1 49.78,45.21 R27.1
  Bottom 0.61: 71.5,71.06 69.28,71.06 68.77,70.55 68.77,65.22 JP4.1
  pour Bottom (isolate 0.305): 74.68,61.98 74.68,70.42 69.85,70.36 69.85,72.39 64.77,72.39 64.77,61.66 57.53,61.66 57.53,87.63 78.99,87.63 78.99,61.98
AUX_AC  (via drill 0.4)
  Top 0.305: R11.2 v87.88,11.75 | TR1.7 98.04,5.88 98.04,6.86 96.97,7.94 90.81,7.94 v89.6,9.14
  Top 0.406: D7.A 87.53,12.73 R11.2 | 95.95,4.15 D1.A | C3.2 96.07,4.28 96.2,4.15
  Top 0.61: 95.95,4.15 96.2,4.15 99.17,4.15 TR1.7
  Bottom 0.305: v87.88,11.75 87.88,10.86 v89.6,9.14
  Bottom 0.406: D6.A 94.3,3.49 95.25,4.45 TR1.7
AUX_REC  (via drill 0.4)
  Top 0.406: v78.61,3.11 78.61,3.94 78.55,4 C7.1 | R3.1 90.42,6.73 90.55,6.6 90.55,4.28 D1.C
  Top 0.61: D1.C 91.33,3.64 90.36,2.67 84.58,2.67 82.17,5.08 C7.1 | v83,2.54 81.6,3.94 78.61,3.94
  Bottom 0.406: R4.1 v78.61,3.11
  pour Bottom (isolate 0.305): 82.68,7.62 92.71,7.62 92.71,0.06 82.68,0.06
BUCK_OUT  (via drill 0.6)
  Top 2.184: L5.2 45.28,31.17 | L6.2 54.16,26.42
  Top 2.54: v49.72,28.83 L6.2 | v49.72,29.78 L5.2
  Bottom 0.305: v50.67,29.78 v49.72,29.78 v48.77,29.78 v48.77,28.83 | v49.72,28.83 v50.67,28.83 | v50.67,27.88 v49.72,27.88 v48.77,27.88 v48.77,28.83 | v48.77,28.83 48.77,28.51 49.28,28.51
  Bottom 0.406: 35.69,50.14 C29.2 C30.2 35.73,47.14 36.45,46.42 38.1,46.42 38.92,47.24 IC2.14 | 22.16,46.8 22.8,46.29 | 35.69,50.14 28.22,50.14 D12.1 | 35.69,50.14 35.69,51.78 C28.2
  Bottom 0.508: C28.2 35.73,51.84
  Bottom 2.54: 22.8,49.02 22.8,46.29 22.8,36.01 | 22.8,49.02 22.8,69.15 26.23,72.58 26.86,72.58 26.87,72.59 Q2.S | v49.72,28.83 49.4,28.51 49.28,28.51 39.81,28.51 36.89,25.59 24.77,25.59 22.8,27.56 22.8,36.01 | Q3.D 22.8,36 22.8,36.01 | D12.1 23.23,49.46 22.8,49.02
CLAMP_C  (via drill 0.4)
  Top 1.016: 48.51,64.64 v48.51,63.88 54.93,63.88 55.94,62.87 v55.94,62.36 v55.94,61.53
  Bottom 0.305: R42.2 50.11,73.28 49.91,73.08 R37.1
  Bottom 0.406: D19.1 62.86,31.21
  Bottom 1.016: D19.1 58.55,31.05 D19.3 | D16.3 62.86,51.18 D16.1 62.86,31.21 | v48.51,64.71 v48.51,63.88 48.51,72.45 48.77,72.7 | v55.94,62.36 v55.94,61.53 55.94,59.88 58.67,57.15 58.67,53.72 | 48.77,72.7 R35.1 C39.2 | 48.77,72.7 R37.1 | 50.61,72.39 49.91,73.08
  Bottom 1.27: 56.01,29.02 D19.3 | 60.45,53.47 D16.3 60.58,53.78 58.74,53.78 58.67,53.72
COMP  (via drill 0.4)
  Top 0.305: v62.23,66.81 62.23,66.93 63.25,67.94 63.25,73.22 64.14,74.11 67.5,74.11 68.64,75.25 68.64,78.42 71.31,81.09 76.01,81.09 JP8.1
  Bottom 0.305: IC3.3 62.84,68.81 62.61,68.58 62.61,67.19 v62.23,66.81 62.04,66.8 R50.2 C46.2
CT_OUT  (via drill 0.4)
  Top 0.305: 76.07,79.41 D9.C 76.45,79.02 v76.45,76.77
  Bottom 0.305: R49.1 R20.1 R21.1 v76.45,76.77
DC_BUS  (via drill 0.4)  (1 unrouted)
  Top 0.305: v42.04,67.56 v42.04,66.8
  Top 0.406: v42.04,66.8 41.59,66.8 41.4,66.99 | v42.04,68.33 v42.04,67.56
  Top 0.813: v10.79,44.13 2.98,44.13 v1.27,42.42
  Top 1.016: TR1.2 TR1.1 96.9,22.02 96.9,22.04 C12.1 92.1,22.04 R6.1 85.83,22.06 83.38,24.51 C13.+
  Top 2.54: 39.81,66.67 TR2.7 39.7,66.55 40.96,66.55 41.4,66.99 41.4,79.63 C32.+
  Bottom 0.305: R7.1 81.92,28.17 C13.+ | C33.1 41.97,67.63 v42.04,67.56 | R30.1 38.41,86.04 C32.+
  Bottom 0.61: 2.79,66.93 2.6,67.12
  Bottom 0.813: v10.79,44.13 15.43,44.13 17.59,46.29 17.59,50.29 11.94,55.94 11.94,58.67 13.59,60.33 13.59,64.77 11.43,66.93 2.79,66.93 | v1.27,42.42 1.21,42.35 1.21,25.78 2.98,24 17.72,24 29.15,12.57 68.52,12.57 80.45,24.51 C13.+
  Bottom 1.016: D15.C 40.44,81.54 37.59,84.39 37.47,84.39 37.05,83.98
  Bottom 2.54: B1.+ 2.6,67.12 2.6,71.82 C31.+
  Bottom 3.81: C32.+ 15.11,84.33 C31.+
DC_OUT
  Top 0.406: 138.18,26.29 147.83,26.29 149.54,24.57 X2.7 | 138.18,26.29 136.31,26.29 L2.2 | C11.1 138.18,26.29
FB  (via drill 0.4)
  Top 0.305: v61.98,62.93 60.64,64.26 60.64,73.28 | 60.64,73.28 v56.33,73.28 | R54.1 64.14,76.77 60.64,73.28
  Bottom 0.254: IC3.2 63.53,68.16 63.18,67.82 63.18,66.55 62.23,65.6 62.23,63.18 v61.98,62.93 | R51.1 61.28,62.87 61.28,62.93
  Bottom 0.305: 61.28,62.93 v61.98,62.93 | v56.33,73.28 R41.1
FB2
  Top 0.305: ZD3.C 113.35,28.01 113.35,26.35 113.41,26.29 R17.1 113.1,25.46 OK1.2
GND  (via drill 0.4, 0.5)  (1 unrouted)
  Top 0.254: 137.86,39.81 v137.86,40.96 137.35,40.39 | v84.01,84.33 84.01,84.96 OK2.3
  Top 0.305: PWR.C 146.53,83.41 v146.49,83.38 | ZD3.A v116.97,28 | 94.04,85.85 IC8.3 94.04,85.85 R86.1 95,83.12 v95.06,83.06
  Top 0.406: v137.48,4.06 137.48,4.45 C14.1 | v144.27,28.45 144.08,28.45 144.08,29.65 JP2.NO
  Top 0.61: C14.1 v136.02,4.83 | C22.2 145.1,18.29 v144.78,18.61 | v144.72,11.81 144.72,12.83 C15.1
  Top 0.813: Q8.2 137.35,40.39 137.35,42.55 C63.2 | Q7.2 137.28,60.4 C58.2
  Top 2.54: Q7.2 140.97,57.21 | Q8.2 141.22,40.13
  Bottom 0.254: IC5.7 v140.34,39.31 | IC5.6 141.6,41.97 141.29,42.29 138.3,42.29 137.86,41.85 v137.86,40.96
  Bottom 0.305: 118.72,85.22 IC6.3
  Bottom 0.406: C57.1 v142.49,55.37 | v140.21,50.8 140.53,51.82 C62.2 | v142.62,51.37 C61.2 | v144.91,41.34 R65.2 | v147,40.32 149.16,40.32 C60.1 | C55.2 146.49,32.67 X4.2 146.49,35.4 C56.2 | v144.27,28.45 144.21,28.32
  Bottom 0.61: TR1.9 119.47,5.62 120.27,4.83 v136.02,4.83 | C52.2 147.32,75.31 C51.-
  Bottom 1.016: TR1.10 TR1.11 119.6,10.7 124.65,15.75 C20.-
  Bottom 1.27: TP1.1 141.67,28.57 | 144.97,80.77 C51.-
  other vias: 140.97,50.8 145.48,18.61 145.48,11.81 137.48,5.59
  pour Top (isolate 0.508, rank 2): 105.92,80.26 145.54,80.26 148.08,77.72 148.08,31.5 141.22,31.5 140.21,32.51 140.21,61.72 138.43,63.5 107.95,63.5 105.16,66.29 105.16,79.5
  pour Bottom (isolate 0.305): 152.78,0.25 121.16,0.25 121.16,4.06 137.16,4.06 137.16,5.59 121.16,5.59 121.16,10.99 125.03,14.86 135,14.86 135,16.64 121.16,16.64 121.16,22.35 109.47,22.35 108.46,23.37 108.46,29.08 152.78,29.08
  pour Bottom: 83.57,90.42 147.32,90.42 147.32,80.01 104.14,80.01 103.63,79.5 103.63,78.74 103.12,78.23 97.54,78.23 96.27,76.96 96.27,76.2 83.57,76.2
GNDA
  Top 2.54: B1.- 5.82,49.58 6.6,50.35 6.6,68.08 SH1.P$1
HD
  Bottom 0.305: IC3.5 54.43,70.11 50.93,66.61 50.93,50.04 50.29,49.4 R23.2
HI_OUT
  Bottom 0.406: IC2.15 38.99,48.51 38.67,48.83 38.67,52.58 36.96,54.29 34.67,54.29 33.27,55.69 33.27,56.71 | D11.C 33.27,56.71 | 33.27,56.71 33.34,56.77 | 33.27,57.4 33.27,57.66 33.21,57.72 31.69,57.72 R22.2
  Bottom 0.61: D11.C 33.27,57.4
HOLE_DL  (via drill 3.2 pad 5.5)
  other vias: 3.5,86.5
HOLE_DR  (via drill 3.2 pad 5.5)
  other vias: 151.5,3.5
HOLE_UR  (via drill 3.2 pad 5.5)
  other vias: 151.5,86.5
L_PULL  (via drill 0.6)
  Top 2.184: 45.28,4.82 L6.1 55.44,4.83 55.56,4.95
  Top 2.54: v55.56,16.07 55.56,4.95
  Bottom 0.305: v54.61,15.11 v54.61,16.07 v54.61,17.02 v55.56,17.02 v56.52,17.02 | v55.56,15.11 v56.52,15.11 v56.52,16.07 56.52,16.64 56.13,16.64
  Bottom 0.406: D19.2 63.43,26.48 63.91,26 | 56.52,16.64 v56.52,17.02
  Bottom 1.016: C38.2 81.98,54.67 81.79,54.48 81.79,45.28 80.14,43.62 78.44,43.62 TR3.P1_DOT
  Bottom 2.54: Q6.D 66.48,26 | 66.48,26 63.91,26 55.56,17.65 v55.56,17.02 v55.56,16.07 | 66.48,26 66.51,25.97 67.94,25.97 77.25,35.27 77.6,35.62 78.44,36.47 78.44,43.62
L_PUSH  (via drill 0.4, 0.5)
  Top 0.406: v58.29,48.26 58.29,49.94 58.23,50
  Top 1.016: TR3.P1 80.33,50.84 81.79,49.38 v81.79,40.13
  Top 2.184: L5.1 54.16,52.77
  Top 2.54: 54.16,52.77 56.93,50 58.23,50 Q5.D
  Bottom 0.406: D16.2 v58.29,48.26
  Bottom 1.016: R25.2 84.02,37.9 v81.79,40.13
  Bottom 2.54: Q5.D 77.58,50 TR3.P1
LD
  Bottom 0.305: IC3.6 54.19,70.76 50.29,66.86 50.29,51.95 R24.2
LO_OUT
  Bottom 0.406: IC2.10 38.92,42.16 38.61,41.85 38.61,39.94 35.68,37.01 D14.C
  Bottom 0.61: D14.C 35.68,32 R29.1
N$1  (via drill 0.4)
  Top 0.305: v130.24,25.65 130.81,25.08 136.4,25.08 136.97,24.51 139.45,24.51 140.46,25.53 146.11,25.53 146.69,24.96 146.69,22.54 149.73,19.49 X2.5 | v130.24,29.84 115.98,29.84 D24.A
  Bottom 0.305: v130.24,25.65 v130.24,29.84
N$2
  Bottom 0.305: R30.2 R36.1 47.07,86.09 TP2.1
N$3  (via drill 0.4)
  Top 0.406: v37.59,47.5 38.86,47.5 v41.21,49.85
  Bottom 0.406: C28.1 C29.1 C30.1 37.43,47.54 v37.59,47.5 | IC2.16 40.51,49.78 40.58,49.85 v41.21,49.85 41.21,53.09 D10.3 41.97,54.99 40.26,54.99
  Bottom 0.61: D10.1 40.26,54.99
N$4
  Top 0.406: JP3.COM 99,27.5 100.78,29.27 C17.1
N$5
  Bottom 1.016: R26.2 R25.1
N$6
  Bottom 0.406: IC5.2 140.34,48.83 C62.1 140.93,48.74 C61.1 143.42,48.74 144.84,50.16 R64.2
N$7
  Top 0.305: R53.1 R58.1 60.26,81.72 61.02,82.49 63.12,82.49 63.31,82.29 IC4.2
N$8
  Bottom 0.406: R60.1 C57.2
N$9
  Bottom 0.305: R76.2 C69.2
N$10
  Bottom 0.305: R81.1 R76.1 C66.2 105.53,86.86 104.46,85.79 104.46,82.42 102.36,80.33 97.66,80.33 97.09,80.9 97.09,81.81 IC7.2
N$11
  Top 0.305: R70.2 PWR.A
N$12
  Bottom 0.305: R78.2 R72.1
N$13
  Bottom 0.61: R44.1 65.92,58.48 67.82,58.48 67.82,58.42 67.63,58.42 67.69,58.36 D20.C 67.69,56.2 Q5.G
N$14
  Bottom 0.61: R48.1 68.46,35.44 D21.C 68.46,32.97 Q6.G
N$15
  Top 2.54: Q2.D 34.02,67 TR2.8
N$16
  Top 0.305: FAULT.A R69.2
N$17
  Bottom 1.016: C38.1 84.84,52.07 R26.1
N$18
  Bottom 0.254: R65.1 144.91,46.04 143.51,47.43 141.92,47.43 141.6,47.12 IC5.3
N$19
  Bottom 0.254: IC3.15 71.47,68.16 71.63,68.01 71.63,66.36 73.03,64.96 R47.1
N$20  (via drill 0.4)
  Top 0.305: v88.33,27.5 v88.33,24.51
  Bottom 0.305: R15.1 90.04,20.23 IC1.8 | R8.2 v88.33,27.5 | R15.1 | R15.1 90.04,24.45 89.98,24.51 v88.33,24.51
N$21
  Bottom 0.61: Q2.G 29.9,61.41 R22.1 31.68,60.12 D11.A
N$22
  Bottom 0.254: R46.1 72.64,66.93 72.14,67.44 72.14,68.33 71.65,68.81 IC3.14
N$23
  Bottom 0.254: IC3.13 72.65,69.46 C43.2
N$24  (via drill 0.4)
  Top 0.61: v82.74,8.95 82.74,9.78 JP1.1
  Bottom 0.61: Q1.E 84.62,7.07 v82.74,8.95 C6.1
N$25  (via drill 0.4)
  Top 0.305: v70.61,66.99 70.61,72.83 v69.28,74.17
  Bottom 0.254: IC3.16 70.41,67.2 v70.61,66.99 70.61,66.61 71.56,65.66 71.56,62.99 ZD4.C 72.45,62.99
  Bottom 0.305: R39.1 v69.28,74.17
N$26
  Top 0.305: IC4.6 64.58,87.88 64.01,88.46 59.24,88.46 58.17,87.38 R56.1 R52.1
N$27  (via drill 0.4)
  Top 0.305: v88.96,16.26 89.6,15.62 89.6,10.54 85.6,6.54 85.6,5.78 | 85.6,5.78 C21.1 | v87.95,7.68 87.5,7.68 85.6,5.78
  Bottom 0.305: C18.2 88.39,16.19 88.9,16.19 v88.96,16.26 89.03,16.32 IC1.5
  Bottom 0.406: ZD2.C 94.37,6.41 D6.C 94.3,6.86 88.77,6.86 v87.95,7.68
N$29
  Bottom 0.406: D14.A 32.78,35.45 R32.1
  Bottom 0.61: D14.A 32.78,31.61 | 32.78,31.61 R29.2 | 32.78,31.61 29.12,31.61 Q3.G
N$30
  Bottom 0.305: R41.2 R42.1
N$31
  Bottom 0.406: 47.85,60.86 47.85,61.12 R18.1
  Bottom 0.61: D10.2 47.85,60.86
N$32
  Top 0.305: OK2.2 77.92,84.96 76.64,86.23 R33.1
N$33
  Bottom 1.016: R1.2 R2.1
N$34
  Top 0.305: IC4.3 64.58,78.42 R54.2 C48.2
N$35
  Bottom 1.016: R37.2 R35.2 D15.A
N$36
  Bottom 0.305: IC2.1 47.69,49.78 R23.1
N$37
  Bottom 0.254: IC3.12 72.46,70.11 C45.2
  Bottom 0.305: R49.2 C45.2
N$38  (via drill 0.4)
  Top 0.305: R55.1 R45.2 67.63,84.26 v65.91,84.26 | v63.31,84.26 IC4.7 | IC4.1 62.04,80.21 v61.78,79.95
  Bottom 0.305: v65.91,84.26 v63.31,84.26 61.78,82.74 v61.78,79.95
N$39  (via drill 0.4)
  Top 0.406: v99.95,77.22 99.95,85.34 101.54,86.93 v117.6,86.93
  Bottom 0.406: C67.1 117.47,86.81 v117.6,86.93 117.73,87.06 IC6.4 | v99.95,77.22 JP6.1
N$40
  Bottom 0.305: R24.1 46.86,51.37 46.35,50.86 44.58,50.86 44.07,50.35 44.07,48.77 44.32,48.51 IC2.2
N$41
  Bottom 0.813: C2.1 14.12,48.42 C5.2
  Bottom 1.016: L1.3 5.64,37.9 SAR1.2
  Bottom 2.032: B1.AC2 6.3,54.53 10.43,50.41 C2.1 5.6,43.6 L1.3
N$42
  Top 0.305: R57.1 67.34,86.52 IC4.5 65.85,85.41 63.69,83.25 60.71,83.25 59.75,82.3 55.56,82.3 54.86,81.6 X3.2
N$43
  Top 0.813: C4.2 17.72,64.85 16.28,63.41
  Top 2.032: C2.2 16.28,63.41 16.54,63.41 20.7,59.24 20.7,45.78 5.6,30.68 L1.1
  Bottom 1.016: SAR2.2 5.61,27.86 L1.1
  Bottom 2.032: B1.AC1 6.75,59.73 C2.2
N$44
  Top 0.305: OK3.4 77.15,81.53 JP8.2
N$45
  Top 0.254: C74.2 92.14,81.08 R85.1
N$46  (via drill 0.4)
  Top 0.305: v95,84.52 99.19,84.52
  Top 0.406: 129.09,88.08 139.76,88.08 140.66,87.18 R69.1 R70.1 | v123.89,81.53 128.02,81.53 129.09,82.61 129.09,88.08 | 129.09,88.08 101.28,88.08 v100.27,87.06 99.19,85.98 99.19,84.52 99.19,78.42 v97.98,77.22
  Bottom 0.305: R79.2 R77.2 92.33,84.78 92.46,84.64 92.46,84.77 94.74,84.77 v95,84.52
  Bottom 0.406: v100.27,87.06 C65.1 100.07,87.22 98.36,87.22 IC7.8 | v97.98,77.22 JP5.2 | v123.89,81.53 C64.1 124.52,81.76 124.52,83.25 123.89,83.25 IC6.8
N$48
  Bottom 0.406: R28.2 45.55,43.5 IC2.6
N$49
  Bottom 0.406: R7.2 85.98,28.57 R8.1
N$50  (via drill 0.4)
  Top 0.305: R19.1 38.81,61.51 TR2.3 39.06,63.12 41.72,63.12 54.1,75.5 59.56,75.5 v63.5,79.44 | D9.A v71.31,79.69
  Bottom 0.305: v71.31,79.69 63.75,79.69 v63.5,79.44
N$53
  Bottom 0.305: R71.1 | 126.24,84.08 R71.1 | R71.1 125.79,84.52 IC6.7 123.07,84.52 121.92,83.37 R74.2
N$54  (via drill 0.4)  (2 unrouted)
  Top 0.406: 62.17,72.77 v62.29,72.64 61.34,71.69 61.34,65.85 62.48,64.71 62.8,64.39 63.88,63.31 R40.1
  Bottom 0.305: IC3.7 65.75,71.41 66.1,71.06 66.1,67.82 65.79,67.5 64.71,67.5
  Bottom 0.356: IC3.7 62.73,71.41 C42.1
  Bottom 0.406: C41.1 | C42.1 62.32,72.62 v62.29,72.64 62.29,73.41 C41.1
N$55
  Bottom 0.406: C37.1 C36.1 37.43,43.5 | 37.43,43.5 C35.1 37.47,44.36 | D13.C 43.05,41.66 41.27,43.43 IC2.11 37.49,43.43 37.43,43.5
N$57  (via drill 0.4)
  Top 0.305: v135.45,87.19 135.45,81.98 JP7.COM
  Bottom 0.305: 92.08,87.31 C72.1 92.39,88.08 93.09,88.77 134.24,88.77 135.45,87.57 v135.45,87.19 | 94.49,86.68 94.49,86.9 IC7.5 94.55,87.28 92.49,87.28
  Bottom 0.406: 92.49,87.28 C72.1
N$58
  Top 0.305: P1.S 134.18,82.3 JP7.NO
N$63
  Bottom 0.406: D13.A 47.69,39.37 R31.1
N$64  (via drill 0.4)
  Top 0.305: v113.47,85.34 103.76,85.34 v102.42,84.01
  Bottom 0.305: C68.2 R75.2 | C68.2 116.78,84.9 | R74.1 120.4,80.84 120.4,83.31 119.18,84.52 IC6.2 116.96,84.52 C68.2 | C68.2 117.1,84.9 | R75.2 | R80.1 v102.42,84.01 | R75.2 113.92,84.9 v113.47,85.34
N$65
  Bottom 0.254: 61.56,68.54 61.15,68.01 60.07,68.01 59.38,67.31 59.38,66.93
  Bottom 0.305: IC3.4 61.99,69.46 C44.2 61.56,68.54 | 59.38,66.93 R50.1 58.93,67.25 58.8,67.37 57.08,67.37 R38.1
N$66  (via drill 0.4)
  Top 0.305: v132.97,61.21 133.1,61.34 133.92,61.34 C58.1 133.35,60.83 v132.97,60.45
  Bottom 0.305: 134.56,60.64 R62.2 133.03,60.39 v132.97,60.45
  Bottom 0.813: R62.2 R61.2
N$67  (via drill 0.5)
  Top 0.406: C63.1 v131.89,43.56 v131.89,44.45
  Bottom 0.406: v131.89,43.56 133.17,43.37 R68.2
  Bottom 0.813: R67.2 R68.2
N$74
  Bottom 0.356: 139.06,46.1 139.06,47.06 R63.2 137.28,48.84 D22.C
  Bottom 0.406: IC5.1 139.06,46.1
N$75
  Bottom 0.406: IC5.8 139.06,38.67 R66.2 138.62,38.29 138.37,38.54 137.02,38.54 D23.C
N$76  (via drill 0.4)
  Top 0.254: R84.2 88.2,81.08 C73.1 | 91.44,87 88.71,87 87.88,86.17 | 87.88,86.17 85.41,83.69 85.41,82.93 85.47,82.87 84.61,82.87 OK3.2 | 88.65,81.59 88.65,85.41 87.88,86.17
  Top 0.305: R84.2 C74.1 92.14,78.55 92.9,77.79 95.5,77.79 96.97,79.25 v96.97,79.69 96.97,81.6 v98.3,82.93 | IC8.1 91.44,87 | 88.65,81.59 C73.1
  Bottom 0.305: 105.47,84.84 C66.1 105.67,84.9 C69.1 104.9,82.04 102.55,79.69 v96.97,79.69 | IC7.1 98.3,81.56 v98.3,82.93
N$100  (via drill 0.4)
  Top 0.305: 69.53,84.26 R45.1 71.25,84.01 v73.34,81.92 | v73.34,78.36 Q4.2
  Bottom 0.305: v73.34,81.92 v73.34,78.36
N$126  (via drill 0.4)
  Top 0.305: D18.C 71.89,75.16 Q4.3 76.2,75.16 77.34,76.31 v77.34,80.14 | v76.9,83.38 76.9,84.1 D17.C
  Bottom 0.305: 77.22,83.06 v76.9,83.38 77.34,82.93 v77.34,80.14
N$130
  Top 0.305: D17.A 74.27,85.88 R33.2
N$132
  Bottom 0.305: R73.1 R71.2 124.17,85.85 IC6.6
N$133
  Bottom 0.305: 81.81,2.83 R4.2 | R4.2 C8.1 | C8.1 81.53,6.8 ZD1.C | 81.66,4.96 C8.1 | Q1.B 81.92,3.5 R4.2
N$134
  Bottom 0.305: R83.2 116.52,82.93 C68.1 | 116.9,82.68 C68.1 | 116.77,82.81 C68.1 | IC6.1 116.84,83.25 C68.1
N$135
  Top 0.305: OK1.1 113.6,24.19 R13.2
N$137
  Top 1.016: D3.C 94.81,16.9 C12.2 94.78,19.21 R6.2
N$138  (via drill 0.4)
  Top 0.305: OK1.4 103.06,24.19 103,24.26 v103,23.56
  Bottom 0.305: IC1.7 90.93,18.86 91.31,19.24 91.31,21.4 C23.2 C25.1 94.43,22.1 94.43,22.36 95.19,23.11 102.55,23.11 v103,23.56
N$139
  Top 0.61: C9.1 R5.2
N$140
  Top 0.61: C3.1 R3.2
N$141  (via drill 0.4)
  Top 0.305: R11.1 87.88,18.67 v87.94,18.73
  Bottom 0.305: IC1.6 88.07,17.59 C24.1 87.94,18.22 v87.94,18.73 R14.2 R12.1
N$144
  Top 0.61: C16.1 R9.2
N$146
  Top 0.61: C19.1 R10.2
N$152
  Bottom 0.305: C23.1 92.01,25.97 R16.1
N$155  (via drill 0.4)
  Top 0.305: D8.C 84.64,15.33 | 84.64,15.33 D7.C | v84.77,19.24 84.77,15.46 84.64,15.33
  Bottom 0.305: 85.6,21.27 85.15,21.27 84.77,20.89 v84.77,19.24
  Bottom 0.406: R12.2 85.98,21.65 85.6,21.27
NFB_IN  (via drill 0.4)
  Top 0.254: 94.04,81.22 R85.2 92.14,83.05 R86.2
  Top 0.305: R85.2 94.36,81.15 95.44,80.07 v95.44,78.93 | IC8.2 92.01,83.25 R86.2 91.44,83.12 90.11,81.79 C73.2
  Bottom 0.254: 109.47,82.8 109.34,82.8 108.2,81.66 106.24,81.66 105.41,80.84 R78.1
  Bottom 0.305: R81.2 R82.2 109.47,82.93 109.47,82.8 | 95.44,78.87 v95.44,78.93 96.27,78.11 101.41,78.11 102.42,79.12 105.34,79.12 R78.1
NFB_OFFSET
  Bottom 0.305: R75.1 R83.1 112.58,80.96 C70.+ 112.4,81.03 R82.1
OK_A  (via drill 0.4)
  Top 0.305: OK3.1 86.81,81.53 | 86.81,81.53 86.81,80.33 87.95,79.18 R84.1 | 86.81,81.53 86.81,83.38 v86.87,83.44
  Bottom 0.305: R79.1 88.84,82.87 88.2,83.5 86.93,83.5 v86.87,83.44
PE  (via drill 3.2 pad 5.5)
  Top 0.61: 103,1.46 103,20.77 100.27,23.5 JP3.NC | 103,1.46 12.46,1.46 C4A.1 | 103,1.46 143.89,1.46 150.37,7.94 X2.1
  Top 0.813: v3.5,3.5 1.21,5.79 1.21,38.92 4,41.72 12.45,41.72 17.78,47.05 17.78,57.47 C5.1 C4.1
  Top 1.27: C5A.1 12.32,6.99 | 12.32,6.99 9.21,6.99 | 9.21,6.99 6.99,6.99 v3.5,3.5 | C4A.1 12.33,6.97 12.32,6.99 | X1.1 9.15,7.04 9.21,6.99
  Bottom 0.406: C59.2 C60.2 153.61,38.67 153.61,10.92 152.02,9.34 X2.1
POUT+  (via drill 0.5)
  Bottom 0.305: 106.24,64.71 106.17,64.77
  Bottom 0.406: R59.1 150.94,64.71
  Bottom 3.81: SH2.P$2 106.87,65.53 | SH3.P$1 102.49,65.98
  other vias: 152.27,64.96 150.5,64.96 151.38,64.96 149.61,64.96 149.61,65.85 150.5,65.85 151.38,65.85 152.27,65.85
  pour Bottom (isolate 0.406, rank 2): 152.78,72.9 101.98,72.9 100.71,71.63 100.71,64.52 153.67,64.52 153.92,64.77 153.92,71.75
  pour Top (no thermals): 149.29,66.23 152.65,66.23 152.65,63.12 149.29,63.12
PREG_OUT+  (via drill 0.4, 0.5)
  Top 0.406: 149.92,58.8 151.09,58.8 L7.2 | 148.27,31.69 148.27,30.54 147.64,29.91 JP2.NC
  Bottom 0.406: R60.2 v152.65,54.86 | C59.1 v148.59,42.55 | C55.1 149.29,32.8 X4.1 149.29,35.27 C56.1 | R59.2 v150.94,60.33
  other vias: 152.65,55.75
  pour Top (isolate 0.406): 148.08,59.94 155.19,59.94 155.19,31.5 148.08,31.5
PULL  (via drill 0.4)
  Top 0.356: v71.88,37.4 71.88,63.94 67.69,68.14 v67.69,71.82
  Bottom 0.356: 71.37,34.23 71.44,34.16 D21.A | IC3.9 67.93,72.06 v67.69,71.82
  Bottom 0.406: R48.2 71.12,36.64 v71.88,37.4
  Bottom 0.61: R48.2 71.12,34.41 D21.A
PUSH
  Bottom 0.356: IC3.8 66.11,72.06 67.69,70.48 D20.A
  Bottom 0.406: D20.A 65.84,60.95 R44.2
REF
  Bottom 0.305: 47.54,47.35 48.2,48.01 50.67,48.01 51.56,48.9 51.56,65.15 R38.2
  Bottom 0.406: IC2.8 44.39,40.89 43.94,41.34 43.94,46.86 44.32,47.24 IC2.3 47.54,47.24 | 47.54,47.24 C34.2 | 47.54,47.24 47.54,47.35
S1_DOT_OUT  (via drill 1.6)
  Bottom 0.254: IC5.4 142.88,44.39 142.69,44.2 138.56,44.2 137.79,44.96 137.79,46.86 137.22,47.43 136.4,47.43
  other vias: 110.93,60.77 113.86,60.77 116.84,60.77 119.82,60.77 119.82,57.78 119.82,54.8 119.82,51.82 110.93,54.8 110.93,57.78 110.93,51.82 113.86,57.78 113.86,54.8 116.84,57.78 116.84,54.8 113.86,51.82 116.84,51.82
  pour Top (isolate 0.406, rank 2, no thermals): 105.41,50.55 108.97,50.55 108.97,54.48 105.41,54.48 105.41,62.23 136.91,62.23 136.91,47.24 105.41,47.24
  pour Bottom (isolate 0.406, rank 2, no thermals): 105.41,50.55 109.47,50.55 109.47,62.23 136.91,62.23 136.91,47.37 105.41,47.37
S1_OUT
  Bottom 2.54: 106.88,53.77 106.87,53.28 106.87,52.9 TR3.S1
  Bottom 3.81: 106.87,53.28 SH2.P$1
S2_DOT_OUT
  Bottom 2.54: TR3.S2_DOT 104.46,41.84 102.11,44.2 102.49,44.58 102.49,44.64
  Bottom 3.81: 102.49,44.64 SH3.P$2
S2_OUT  (via drill 1.6)
  Bottom 0.254: 136.72,42.86 136.78,42.8 142.69,42.8 142.88,42.61 IC5.5
  other vias: 119.82,42.29 119.82,39.31 119.82,36.32 119.82,33.34 116.84,33.34 113.86,33.34 110.87,33.34 110.87,36.32 110.87,42.23 110.87,39.31 113.86,36.32 113.86,39.31 113.86,42.29 116.84,36.32 116.84,39.31 116.84,42.29
  pour Top (isolate 0.305, no thermals): 105.41,39.88 108.97,39.88 108.97,43.69 105.41,43.69 105.41,46.74 136.91,46.74 136.91,31.75 109.47,31.75 107.95,33.27 105.41,33.27
  pour Bottom (isolate 0.305, no thermals): 105.41,39.88 108.97,39.88 108.97,43.69 105.41,43.69 105.41,46.74 136.91,46.74 136.91,31.75 109.47,31.75 107.95,33.27 105.41,33.27
SR_OUT1  (via drill 0.4)
  Top 0.356: 137.41,52 137.41,51.37 v137.48,51.31
  Top 0.406: 137.41,52 Q7.1
  Bottom 0.356: D22.A 136.28,51.74 R63.1 137.54,51.24 v137.48,51.31
SR_OUT2  (via drill 0.4)
  Top 0.406: 137.29,34.48 Q8.1 137.54,34.61 v137.54,36.13
  Bottom 0.406: R66.1 137.73,36.33 v137.54,36.13 137.36,35.95 D23.A
U_MON
  Top 0.305: 146.81,81.34 147.1,81.06 | 147.1,81.06 152.41,75.7 | 152.41,75.7 153.73,74.36 | JP7.NC 146.24,81.92 147.1,81.06 | 152.41,75.7 153.73,74.37 153.73,29.97 150.88,27.11 X2.8
U_MON1
  Bottom 0.305: IC7.6 IC7.7 97.09,87.69 97.66,88.27 101.79,88.27 102.42,87.63 R80.2
ULVO  (via drill 0.4)
  Top 0.305: v70.36,77.09 71.22,77.09 D18.A
  Bottom 0.305: TP2.2 49.07,86.09 | 49.07,86.09 R36.2 | v70.36,77.09 R39.2 C40.1 R43.1 57.15,77.09 56.77,77.47 56.77,82.93 53.61,86.09 49.07,86.09
V+  (via drill 0.4)
  Top 0.305: R17.2 117.35,26.1 118.36,27.11 v118.36,28.89
  Top 0.406: v143.13,28.89 v118.36,28.89
  Top 0.61: v143.13,24.51 143.13,22.29 C22.1
  Top 1.016: C22.1 145.98,20.32 149.35,16.95 X2.4 | C22.1 | L4.2 144.75,20.67 C22.1
  Bottom 0.406: R64.1 145.41,48.26 146.88,46.8 146.88,41.66 143.13,37.91 v143.13,28.89 | v118.36,28.89 116.39,30.86 107.57,30.86 107,31.43 104.46,31.43 103.44,32.45 103.44,37.59 98.61,42.42 98.61,74.87 JP5.1
  Bottom 0.61: v143.13,24.51 v143.13,28.89
V-  (via drill 0.4)
  Top 0.406: C15.2 143.13,10.16 142.56,10.73 v142.56,20.19 | v139.57,29.78 139.57,29.84 131.76,29.84 130.81,30.8 108.97,30.8 v107.5,32.26
  Top 0.61: L3.2 143.19,8.25 C15.2 147.13,10.16 148.84,11.87 X2.2
  Bottom 0.406: v142.56,20.19 139.57,23.18 v139.57,29.78 | v107.5,32.26 104.9,32.26 104.27,32.89 104.27,37.97 99.44,42.8 99.44,74.8 JP6.2
VIPER_D
  Top 1.016: D3.A 95.08,11.95 TR1.4
  pour Bottom (isolate 0.305, no thermals): 93.98,10.92 93.98,15.3 96.77,15.3 96.77,12.64 100.2,12.64 100.2,11.3 96.77,11.3 96.77,10.92

## Text on the board
tPlace: EEZ CF-DIC / (11/2018 r5B1) | HI-SIDE | SREC1 | PUSH | SREC2 | LO-SIDE | CAUTION! / HIGH VOLTAGE | PULL | AC in
bPlace: HI-SIDE | PUSH | LO-SIDE | PULL | X2 connector | 8 U_MON | 7 Bias+ | CAUTION! / HIGH VOLTAGE | 6 Bias- | 5 !FAULT! | 4 V+ | AC in | 3 Gnd | 2 V- | 1 PE | EEZ CF-DIC (11/2018 r5B1) | Project source code: github.com/eez-open/CF-DIC
Measures: Licensed under the TAPR Open Hardware License (www.tapr.org/OHL)